# Altium schematic sheet schematic.SchDoc
size A3
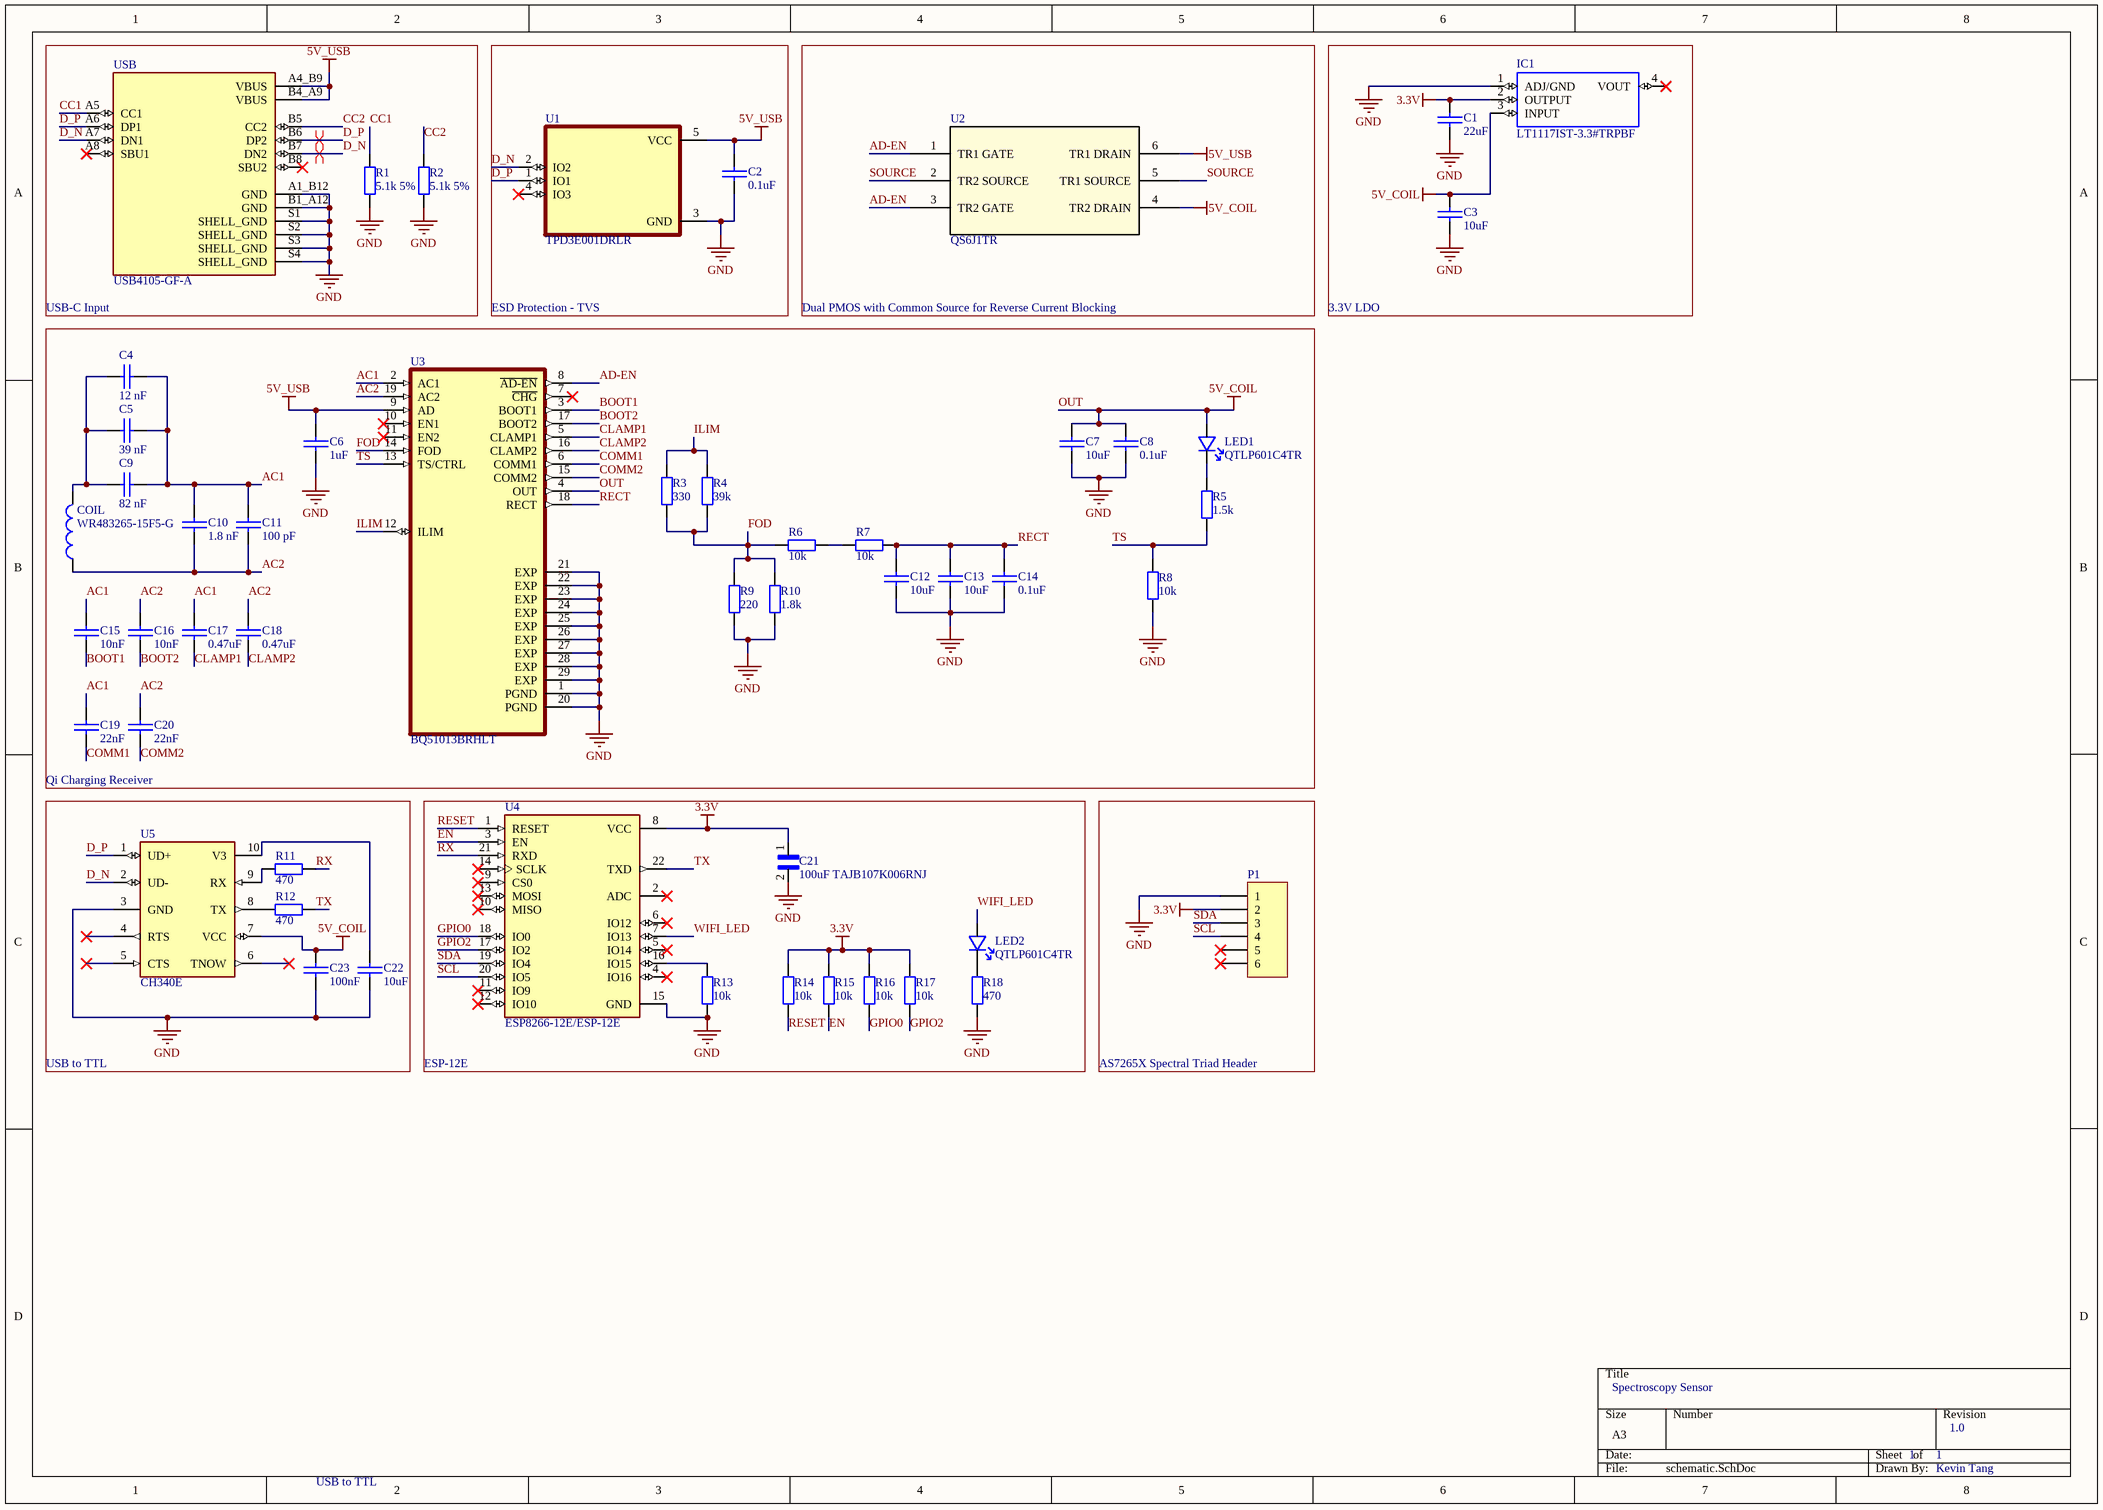
[diagram p0: schematic.SchDoc]

## Parts
C1  22uF  [CAP0603]
C2  0.1uF  [CAP0603]
C3  10uF  [CAP0603]
C4  12 nF  [CAP0603]
C5  39 nF  [CAP0603]
C6  1uF  [CAP0603]
C7  10uF  [CAP0603]
C8  0.1uF  [CAP0603]
C9  82 nF  [CAP0603]
C10  1.8 nF  [CAP0603]
C11  100 pF  [CAP0603]
C12  10uF  [CAP0603]
C13  10uF  [CAP0603]
C14  0.1uF  [CAP0603]
C15  10nF  [CAP0603]
C16  10nF  [CAP0603]
C17  0.47uF  [CAP0603]
C18  0.47uF  [CAP0603]
C19  22nF  [CAP0603]
C20  22nF  [CAP0603]
C21  100uF TAJB107K006RNJ  [CAPPC3528X210N]
C22  10uF  [CAP0603]
C23  100nF  [CAP0603]
COIL  WR483265-15F5-G  [ece-INDUCTOR1005]
IC1  LT1117IST-3.3#TRPBF  [SOT230P700X170-4N]
LED1  QTLP601C4TR  [LED0603P]
LED2  QTLP601C4TR  [LED0603P]
P1  Header 6  [ece-HDR1X6]  (value not drawn)
R1  5.1k 5%  [RES0603]
R2  5.1k 5%  [RES0603]
R3  330  [RES0603]
R4  39k  [RES0603]
R5  1.5k  [RES0603]
R6  10k  [RES0603]
R7  10k  [RES0603]
R8  10k  [RES0603]
R9  220  [RES0603]
R10  1.8k  [RES0603]
R11  470  [RES0603]
R12  470  [RES0603]
R13  10k  [RES0603]
R14  10k  [RES0603]
R15  10k  [RES0603]
R16  10k  [RES0603]
R17  10k  [RES0603]
R18  470  [RES0603]
U1  TPD3E001DRLR  [SOT50P160X60-5N]
U2  QS6J1TR  [TRANS_QS6_ROM]
U3  BQ51013BRHLT  [IC_MSP430FR2522IRHLR]
U4  ESP8266-12E/ESP-12E  [XCVR_ESP8266-12E/ESP-12E]
U5  CH340E  [MSOP10]
USB  USB4105-GF-A  [GCT_USB4105-GF-A]

## Blocks framed on the sheet
USB-C Input: R1 R2 USB
ESD Protection - TVS: C2 U1
Dual PMOS with Common Source for Reverse Current Blocking: U2
3.3V LDO: C1 C3 IC1
Qi Charging Receiver: C4-C20 COIL LED1 R3-R10 U3
ESP-12E: C21 LED2 R13-R18 U4
AS7265X Spectral Triad Header: P1

## Nets
3.3V: C1.1 C21.1 IC1.2(OUTPUT) P1.2 R14.2 R15.2 R16.2 R17.2 U4.8(VCC)
5V_USB: C2.1 C6.1 U1.5(VCC) U2.6(TR1_DRAIN) U3.9(AD) USB.A4_B9(VBUS) USB.B4_A9(VBUS)
GND: C1.2 C2.2 C3.2 C6.2 C7.2 C8.2 C12.2 C13.2 C14.2 C21.2 C22.2 C23.2 IC1.1(ADJ/GND) P1.1 R1.1 R2.1 R8.1 R9.1 R10.1 R13.1 R18.2 U1.3(GND) U3.1(PGND) U3.20(PGND) U3.21(EXP) U3.22(EXP) U3.23(EXP) U3.24(EXP) U3.25(EXP) U3.26(EXP) U3.27(EXP) U3.28(EXP) U3.29(EXP) U4.15(GND) U5.3(GND) USB.A1_B12(GND) USB.B1_A12(GND) USB.S1(SHELL_GND) USB.S2(SHELL_GND) USB.S3(SHELL_GND) USB.S4(SHELL_GND)
OUT: C3.1 C7.1 C8.1 C23.1 IC1.3(INPUT) LED1.1 U2.4(TR2_DRAIN) U3.4(OUT) U5.7(VCC)  [also labelled 5V_COIL]
AC1: C4.2 C5.2 C9.2 C10.1 C11.1 C15.1 C17.1 C19.1 U3.2(AC1)
AC2: C10.2 C11.2 C16.1 C18.1 C20.1 COIL.1 U3.19(AC2)
AD-EN: U2.1(TR1_GATE) U2.3(TR2_GATE) U3.8(~{AD-EN})
BOOT1: C15.2 U3.3(BOOT1)
BOOT2: C16.2 U3.17(BOOT2)
CC1: R1.2 USB.A5(CC1)
CC2: R2.2 USB.B5(CC2)
CLAMP1: C17.2 U3.5(CLAMP1)
CLAMP2: C18.2 U3.16(CLAMP2)
COMM1: C19.2 U3.6(COMM1)
COMM2: C20.2 U3.15(COMM2)
D_N: U1.2(IO2) U5.2(UD-) USB.A7(DN1) USB.B7(DN2)
D_P: U1.1(IO1) U5.1(UD+) USB.A6(DP1) USB.B6(DP2)
EN: R15.1 U4.3(EN)
FOD: R3.1 R4.1 R6.1 R9.2 R10.2 U3.14(FOD)
GPIO0: R16.1 U4.18(IO0)
GPIO2: R17.1 U4.17(IO2)
ILIM: R3.2 R4.2 U3.12(ILIM)
RECT: C12.1 C13.1 C14.1 R7.2 U3.18(RECT)
RESET: R14.1 U4.1(RESET)
RX: R11.2 U4.21(RXD)
SCL: P1.4 U4.20(IO5)
SDA: P1.3 U4.19(IO4)
SOURCE: U2.2(TR2_SOURCE) U2.5(TR1_SOURCE)
TS: R5.1 R8.2 U3.13(TS/CTRL)
TX: R12.2 U4.22(TXD)
WIFI_LED: LED2.1 U4.7(IO13)
NetC4_1: C4.1 C5.1 C9.1 COIL.2
NetC22_1: C22.1 U5.10(V3)
NetLED1_2: LED1.2 R5.2
NetLED2_2: LED2.2 R18.1
NetR6_2: R6.2 R7.1
NetR11_1: R11.1 U5.9(RX)
NetR12_1: R12.1 U5.8(TX)
NetR13_2: R13.2 U4.16(IO15)

Not connected (* = marked no-connect by the designer): IC1 4(VOUT)*; P1 5* 6*; U1 4(IO3)*; U3 7(~{CHG})* 10(EN1)* 11(EN2)*; U4 2(ADC)* 4(IO16)* 5(IO14)* 6(IO12)* 9(CS0)* 10(MISO)* 11(IO9)* 12(IO10)* 13(MOSI)* 14(SCLK)*; U5 4(RTS)* 5(CTS)* 6(TNOW)*; USB A8(SBU1)* B8(SBU2)*

## Layout directives
differential pair: D_N, D_P

## Notes on the sheet
- USB to TTL
- Spectroscopy Sensor
- 1
- 1.0
- Kevin Tang

## Library data of the parts
C1-C20 C22 C23 = CAP SM0603: SM capacitor
C21 = TAJB107K006RNJ: 100ÂµF Molded Tantalum Capacitors 6.3V 1411 _3528 Metric_, 1210 1.7Ohm; MF: AVX; Value: *; Availability: Unavailable; Package: 1210 AVX; SnapEDA_Link: https://www.snapeda.com/parts/TAJB107K006RNJ/AVX/view-part/381691/?ref=snap; Price: None; MP: TAJB107K006RNJ
COIL = Inductor: inductor Surface Mount; Value: *
IC1 = AZ1117IH-3.3TRG1: Linear Voltage Regulator IC Positive Fixed 1 Output 1A SOT-223; MF: Diodes Inc.; Price: None; Purchase-URL: https://pricing.snapeda.com/search/part/AZ1117IH-3.3TRG1/?ref=eda; Check_prices: https://www.snapeda.com/parts/AZ1117IH-3.3TRG1/Diodes%20Inc./view-part/490259/?ref=eda; Value: *; MP: AZ1117IH-3.3TRG1; Availability: Warning; SnapEDA_Link: https://www.snapeda.com/parts/AZ1117IH-3.3TRG1/Diodes%20Inc./view-part/490259/?ref=snap; Package: SOT-223 Diodes Inc.
LED1 LED2 = LNJ337W83RA: LED SM 0603 GREEN 1V95 FWD VOLTAGE; Supplier 1: Digi-Key; Forward Voltage: 1V95; Supplier Part Number 1: LNJ337W83RACT-ND
P1 = Header 6: Header, 6-Pin; LatestRevisionDate: 17-Jul-2002; LatestRevisionNote: Re-released for DXP Platform.; Publisher: Altium Limited
R1-R18 = Res SM 0603: Resistor
U1 = TPD3E001DRLR: Low-capacitance 3-channel +/-15K-V ESD-protection array for high-speed data interfaces 5-SOT-5X3 -40 to 85; MF: Texas Instruments; Package: SOT-5X3-5 Texas Instruments; SnapEDA_Link: https://www.snapeda.com/parts/TPD3E001DRLR/Texas%20Instruments/view-part/382422/?ref=snap; Purchase-URL: https://pricing.snapeda.com/search/part/TPD3E001DRLR/?ref=eda; MP: TPD3E001DRLR; Digi-Key_Part_Number: 296-21885-1-ND; Value: *; Check_prices: https://www.snapeda.com/parts/TPD3E001DRLR/Texas%20Instruments/view-part/382422/?ref=eda
U2 = QS6J1TR: No Description Available; Vendor: ROHM Semiconductor; Built_By: EMA_Matt; SourceLibrary: Rohm_2019-09-23; Manufacturer_Part_Number: QS6J1TR; Copyright: Copyright (C) 2018 Accelerated Designs. All rights reserved; RefDes: RefDes; Type: DEV
U3 = BQ51013BRHLT: WPC 1.1 Compatible Fully integrated Wireless power Receiver IC 20-VQFN 0 to 125; MF: Texas Instruments; Texas_Instruments-Purchase-URL: https://snapeda.com/shop?store=Texas+Instruments&id=46178; MP: BQ51013BRHLT; DigiKey-Purchase-URL: https://snapeda.com/shop?store=DigiKey&id=46178; SnapEDA_Link: https://www.snapeda.com/parts/BQ51013BRHLT/Texas%20Instruments/view-part/46178/?ref=snap; Mouser-Purchase-URL: https://snapeda.com/shop?store=Mouser&id=46178; Value: *; Digi-Key_Part_Number: 296-35638-1-ND; Package: VQFN-20 Texas Instruments
U4 = ESP8266-12E/ESP-12E: This WiFi module has a 32-bit MCU micro and clock speeds supporting 80 MHz or 160 MHz. Supports the RTOS and integrated Wi-Fi MAC/BB/RF/PA/LNA, and has an on-board antenna.; MF: AI-Thinker; Price: None; Package: None; Value: *; MP: ESP8266-12E/ESP-12E; Availability: Unavailable; SnapEDA_Link: https://www.snapeda.com/parts/ESP8266-12E/ESP-12E/AI-Thinker/view-part/106414/?ref=snap
U5 = CH340E: USB to serial chip CH340; MF: WCH; MP: CH340E; Availability: Unavailable; SnapEDA_Link: https://www.snapeda.com/parts/CH340E/WCH/view-part/3625184/?ref=snap; Package: Package Analog Devices; Price: None; Value: *
USB = USB4105-GF-A: USB-C (USB TYPE-C) USB 2.0 Receptacle Connector 24 (16+8 Dummy) Position Surface Mount, Right Angle; Through Hole; MF: GCT; Price: None; Value: *; MP: USB4105-GF-A; Package: None; Purchase-URL: https://pricing.snapeda.com/search/part/USB4105-GF-A/?ref=eda; SnapEDA_Link: https://www.snapeda.com/parts/USB4105-GF-A/Global%20Connector%20Technology/view-part/4423780/?ref=snap; Check_prices: https://www.snapeda.com/parts/USB4105-GF-A/Global%20Connector%20Technology/view-part/4423780/?ref=eda; Availability: Warning